# EAGLE design ProgramMemory (EAGLE 9.6.2)
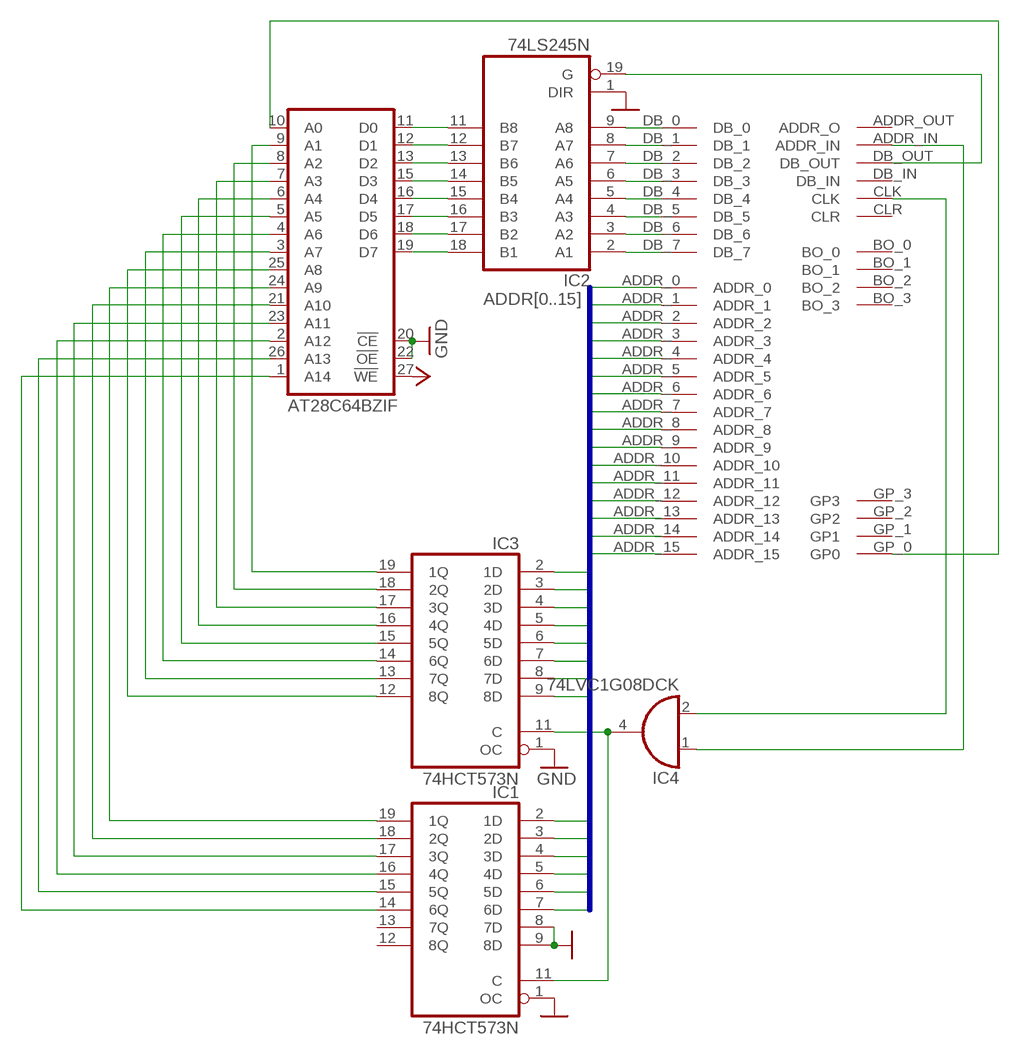
[diagram p0: schematic, sheet 1]

## Parts
IC1  74HCT573N  [DIL20]
IC2  74LS245N  [DIL20]
IC3  74HCT573N  [DIL20]
IC4  74LVC1G08DCK  [SC70-5]
U$1  BACKPLATE_INTERFACEEDGE_FINGER  [BACK_INTERFACE-FOOT]
U$2  AT28C64BZIF  [28-WIDE_ZIF-FOOT]

## Nets
ADDR0: IC3.2(1D) U$1.ADDR_0
ADDR1: IC3.3(2D) U$1.ADDR_1
ADDR2: IC3.4(3D) U$1.ADDR_2
ADDR3: IC3.5(4D) U$1.ADDR_3
ADDR4: IC3.6(5D) U$1.ADDR_4
ADDR5: IC3.7(6D) U$1.ADDR_5
ADDR6: IC3.8(7D) U$1.ADDR_6
ADDR7: IC3.9(8D) U$1.ADDR_7
ADDR8: IC1.2(1D) U$1.ADDR_8
ADDR9: IC1.3(2D) U$1.ADDR_9
ADDR10: IC1.4(3D) U$1.ADDR_10
ADDR11: IC1.5(4D) U$1.ADDR_11
ADDR12: IC1.6(5D) U$1.ADDR_12
ADDR13: IC1.7(6D) U$1.ADDR_13
ADDR14: U$1.ADDR_14
ADDR15: U$1.ADDR_15
DATA0: IC2.9(A8) U$1.DB_0
DATA1: IC2.8(A7) U$1.DB_1
DATA2: IC2.7(A6) U$1.DB_2
DATA3: IC2.6(A5) U$1.DB_3
DATA4: IC2.5(A4) U$1.DB_4
DATA5: IC2.4(A3) U$1.DB_5
DATA6: IC2.3(A2) U$1.DB_6
DATA7: IC2.2(A1) U$1.DB_7
GND: IC1.1(OC) IC1.8(7D) IC1.9(8D) IC2.1(DIR) IC3.1(OC) U$2.20(!CE) U$2.22(!OE)
N$1: U$1.GP_0(GP0) U$2.10(A0)
N$2: IC3.19(1Q) U$2.9(A1)
N$3: IC3.18(2Q) U$2.8(A2)
N$4: IC3.17(3Q) U$2.7(A3)
N$5: IC3.16(4Q) U$2.6(A4)
N$6: IC3.15(5Q) U$2.5(A5)
N$7: IC3.14(6Q) U$2.4(A6)
N$8: IC3.13(7Q) U$2.3(A7)
N$9: IC3.12(8Q) U$2.25(A8)
N$10: IC1.19(1Q) U$2.24(A9)
N$11: IC1.18(2Q) U$2.21(A10)
N$12: IC1.17(3Q) U$2.23(A11)
N$13: IC1.16(4Q) U$2.2(A12)
N$14: IC1.15(5Q) U$2.26(A13)
N$15: IC1.14(6Q) U$2.1(A14)
N$16: IC1.11(C) IC3.11(C) IC4.4(O)
N$17: IC4.2(I1) U$1.CLK
N$18: IC4.1(I0) U$1.ADDR_IN
N$20: IC2.19(G) U$1.DB_OUT
RS_BREAKOUT0: IC2.11(B8) U$2.11(D0)
RS_BREAKOUT1: IC2.12(B7) U$2.12(D1)
RS_BREAKOUT2: IC2.13(B6) U$2.13(D2)
RS_BREAKOUT3: IC2.14(B5) U$2.15(D3)
RS_BREAKOUT4: IC2.15(B4) U$2.16(D4)
RS_BREAKOUT5: IC2.16(B3) U$2.17(D5)
RS_BREAKOUT6: IC2.17(B2) U$2.18(D6)
RS_BREAKOUT7: IC2.18(B1) U$2.19(D7)
VCC: U$2.27(!WE)
Unconnected: IC1.12(8Q) IC1.13(7Q) U$1.ADDR_OUT(ADDR_O) U$1.BO_0 U$1.BO_1 U$1.BO_2 U$1.BO_3 U$1.CLR U$1.DB_IN U$1.GP_1(GP1) U$1.GP_2(GP2) U$1.GP_3(GP3) U$1.NC_0 U$1.NC_1 U$1.NC_2 U$1.NC_3 U$1.NC_4 U$1.NC_5 U$1.NC_6 U$1.NC_7 U$1.NC_8 U$1.NC_9 U$1.NC_10 U$1.NC_11 U$1.NC_12 U$1.NC_13 U$1.NC_14 U$1.NC_15 U$1.NC_16 U$1.NC_17 U$1.NC_18 U$1.NC_19 U$1.NC_20 U$1.NC_21

## Buses
ADDR[0..15]

## Power pins joined to a net without a drawn wire
GND: IC1.10(GND) IC2.10(GND) IC3.10(GND) IC4.3(GND) U$1.GND_0(GND) U$1.GND_1(GND) U$2.14(GND)
VCC: IC1.20(VCC) IC2.20(VCC) IC3.20(VCC) IC4.5(VCC) U$1.VCC_0(VCC) U$1.VCC_1(VCC) U$2.28(VCC)

## Library data of the parts
IC1 IC3 = 74xx-eu:74*573: 8-bit D latch BUS DRIVER
IC2 = 74xx-eu:74*245: Octal BUS TRANSCEIVER, 3-state
IC4 = 74xx-little-de:74*1G08: 2-input AND gate
U$1 = Computer:BACKPLATE_INTERFACE
U$2 = Computer:AT28C64B

## Board
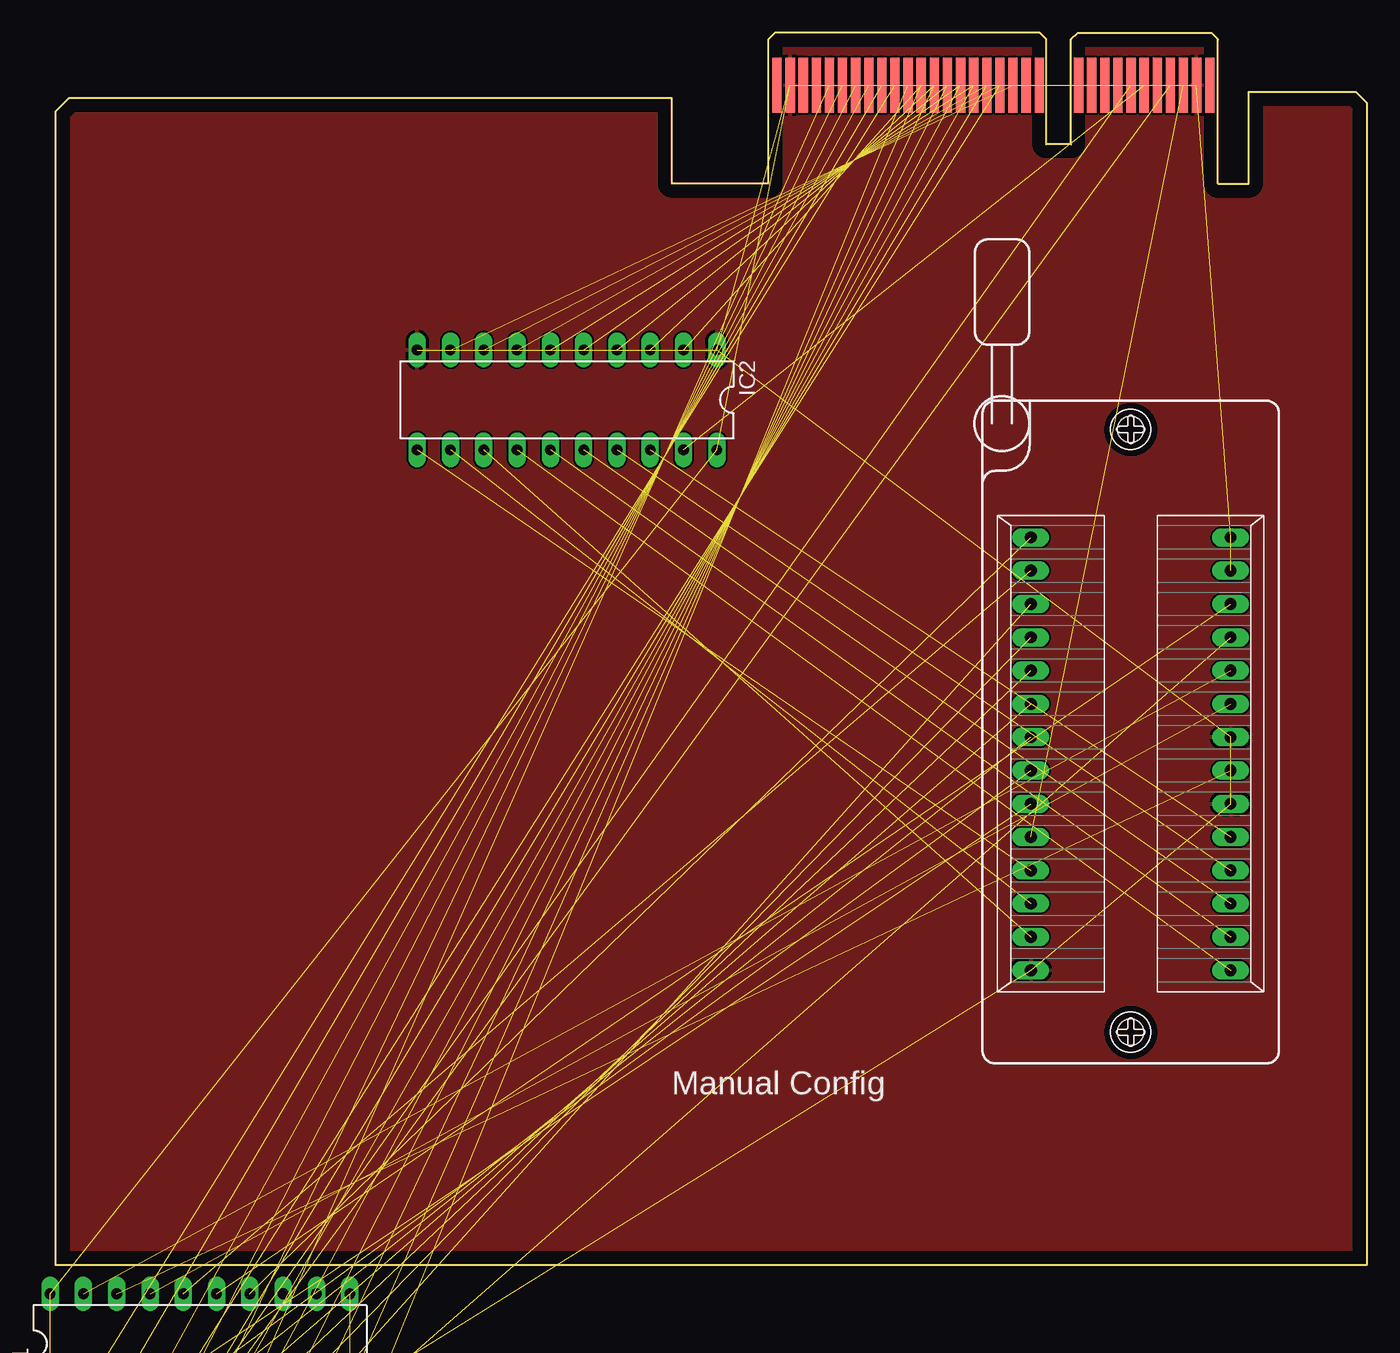
[diagram p1: board, top side]
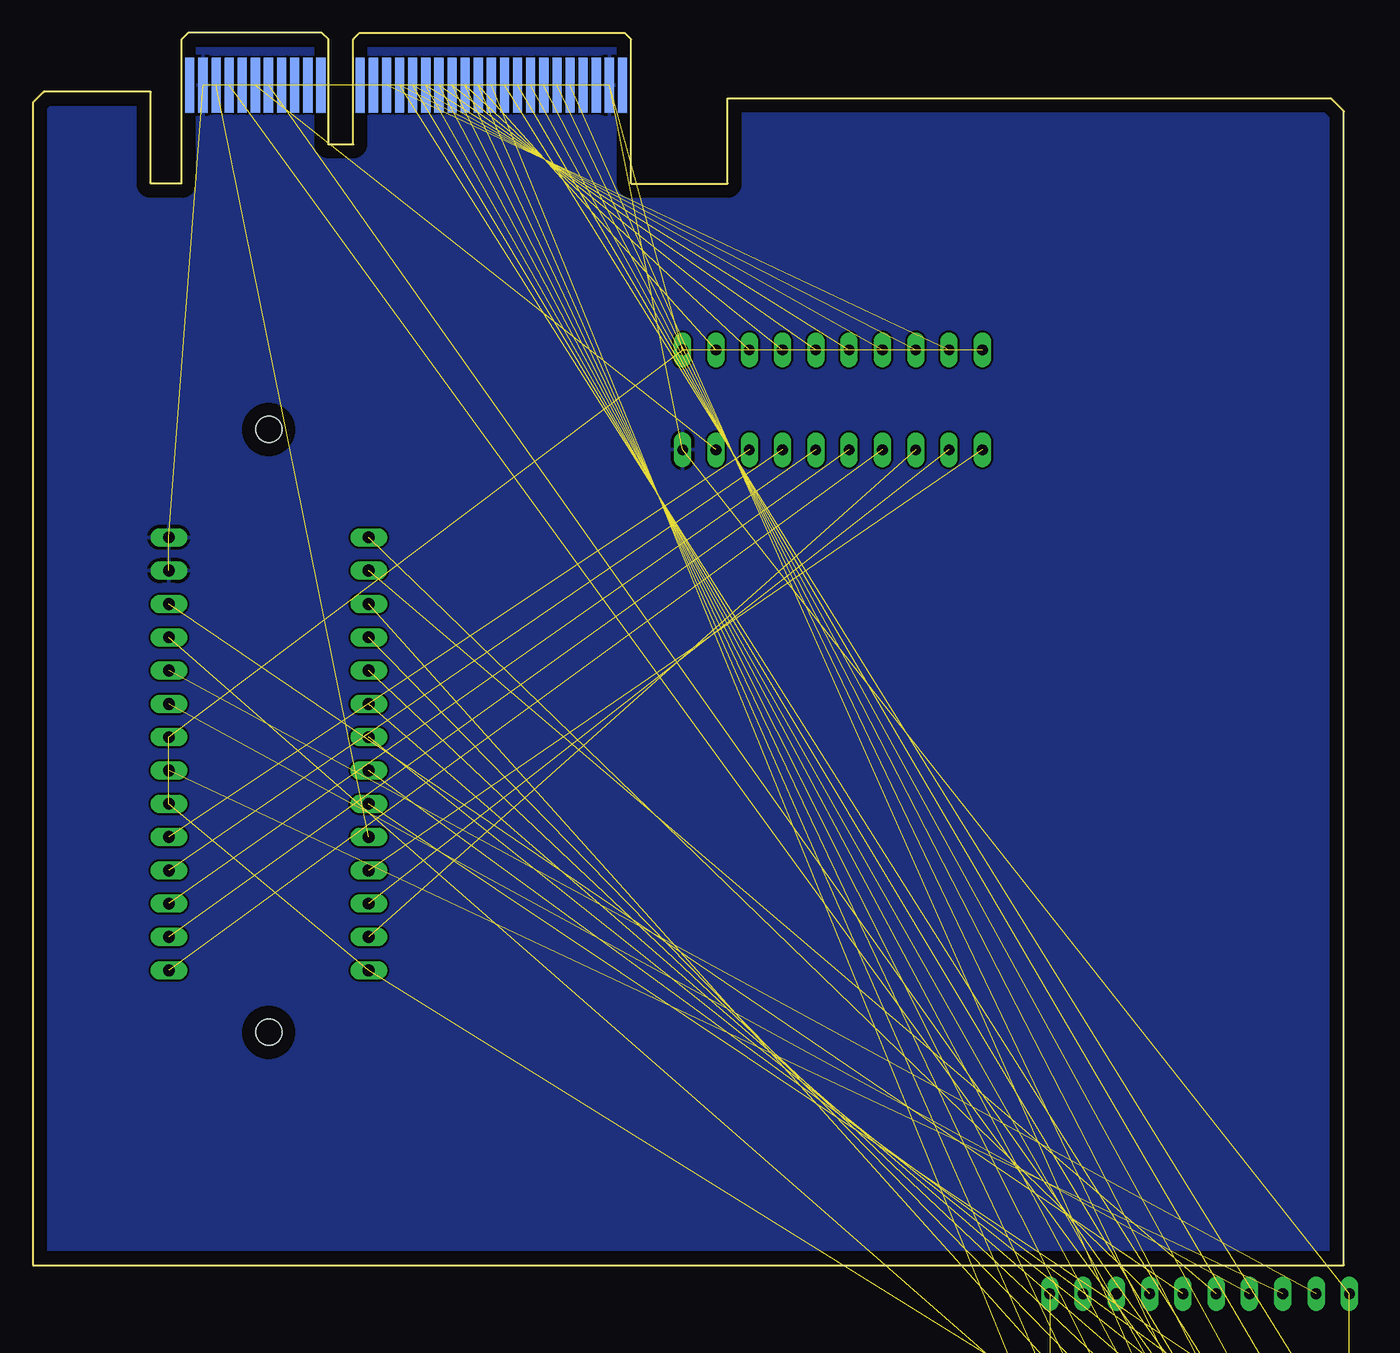
[diagram p2: board, bottom side, seen from below]

Size 100 x 94 mm. Coordinates in mm from the lower left corner, seen from the top.
Outline: 0,0 0,88 1,89 47,89 47,82.5 54.35,82.5 54.35,93.5 54.85,94 75.05,94 75.55,93.5 75.55,85.5 77.45,85.5 77.45,93.5 77.95,94 88.15,94 88.65,93.5 88.65,82.5 91,82.5 91,89.5 99.15,89.5 100,88.65 100,0 0,0
Copper layers (1*16): Top 0.035mm / dielectric 1.5mm / Bottom 0.035mm
Design rules "default *": minimum track width 19mil, minimum drill 0.35mm, track to track 6mil, track to pad 6mil, pad to pad 6mil, via to via 6mil, smd to smd 6mil, copper to edge 40mil, drill to drill 6mil, minimum pad ring 10mil, minimum via ring 8mil, stop-mask expansion 4mil, vias tented up to drill 0mil, thermal gap 10mil

### Footprints (pad centres in the part's own frame; a part is rotated, then mirrored left to right if it is on the bottom)
DIL20 = drill 0.813 long: 1 -11.43,-3.81; 2 -8.89,-3.81; 3 -6.35,-3.81; 4 -3.81,-3.81; 5 -1.27,-3.81; 6 1.27,-3.81; 7 3.81,-3.81; 8 6.35,-3.81; 9 8.89,-3.81; 10 11.43,-3.81; 11 11.43,3.81; 12 8.89,3.81; 13 6.35,3.81; 14 3.81,3.81; 15 1.27,3.81; 16 -1.27,3.81; 17 -3.81,3.81; 18 -6.35,3.81; 19 -8.89,3.81; 20 -11.43,3.81
SC70-5 = smd 0.4 x 0.7: 1 -0.65,-0.85; 2 0,-0.85; 3 0.65,-0.85; 4 0.65,0.85; 5 -0.65,0.85
BACK_INTERFACE-FOOT = smd 0.7 x 4.2: ADDR_0 17.02,0; ADDR_1 16.02,0; ADDR_2 15.02,0; ADDR_3 14.02,0; ADDR_4 13.02,0; ADDR_5 12.02,0; ADDR_6 11.02,0; ADDR_7 10.02,0; ADDR_8 9.02,0; ADDR_9 8.02,0; ADDR_10 7.02,0; ADDR_11 6.02,0; ADDR_12 5.02,0; ADDR_13 4.02,0; ADDR_14 3.02,0; ADDR_15 2.02,0; ADDR_IN 27.02,0; ADDR_OUT 26.02,0; CLK 30.02,0; CLR 31.02,0; DB_IN 29.02,0; DB_OUT 28.02,0; GND_0 32.02,0; GND_1 1.02,0; NC_0 33.02,0; NC_1 25.02,0; NC_2 24.02,0; NC_3 23.02,0; NC_4 20.02,0; NC_5 19.02,0; NC_6 18.02,0; NC_7 0.02,0 | smd 0.7 x 4.2 bottom: BO_0 27.02,0; BO_1 26.02,0; BO_2 25.02,0; BO_3 24.02,0; DB_0 18.02,0; DB_1 17.02,0; DB_2 16.02,0; DB_3 15.02,0; DB_4 14.02,0; DB_5 13.02,0; DB_6 12.02,0; DB_7 11.02,0; GP_0 31.02,0; GP_1 30.02,0; GP_2 29.02,0; GP_3 28.02,0; NC_8 33.02,0; NC_9 23.02,0; NC_10 20.02,0; NC_11 19.02,0; NC_12 10.02,0; NC_13 9.02,0; NC_14 8.02,0; NC_15 7.02,0; NC_16 6.02,0; NC_17 5.02,0; NC_18 4.02,0; NC_19 3.02,0; NC_20 2.02,0; NC_21 0.02,0; VCC_0 32.02,0; VCC_1 1.02,0
28-WIDE_ZIF-FOOT = drill 0.9 long: 1 -16.51,-7.62; 2 -13.97,-7.62; 3 -11.43,-7.62; 4 -8.89,-7.62; 5 -6.35,-7.62; 6 -3.81,-7.62; 7 -1.27,-7.62; 8 1.27,-7.62; 9 3.81,-7.62; 10 6.35,-7.62; 11 8.89,-7.62; 12 11.43,-7.62; 13 13.97,-7.62; 14 16.51,-7.62; 15 16.51,7.62; 16 13.97,7.62; 17 11.43,7.62; 18 8.89,7.62; 19 6.35,7.62; 20 3.81,7.62; 21 1.27,7.62; 22 -1.27,7.62; 23 -3.81,7.62; 24 -6.35,7.62; 25 -8.89,7.62; 26 -11.43,7.62; 27 -13.97,7.62; 28 -16.51,7.62 | hole 2: 21.24,0; -24.74,0

### Placement (x,y rotation side)
IC1  11,-6 0 top
IC2  39,66 180 top
IC3  11,-17 0 top  (outside the outline)
IC4  0,-26 0 top  (outside the outline)
U$1  55,90 0 top
U$2  82,39 270 top

### Tracks (layer width: path | path; a pad name or v marks a point on that pad's centre or on a via)
ADDR0  (1 unrouted)
ADDR1  (1 unrouted)
ADDR2  (1 unrouted)
ADDR3  (1 unrouted)
ADDR4  (1 unrouted)
ADDR5  (1 unrouted)
ADDR6  (1 unrouted)
ADDR7  (1 unrouted)
ADDR8  (1 unrouted)
ADDR9  (1 unrouted)
ADDR10  (1 unrouted)
ADDR11  (1 unrouted)
ADDR12  (1 unrouted)
ADDR13  (1 unrouted)
DATA0  (1 unrouted)
DATA1  (1 unrouted)
DATA2  (1 unrouted)
DATA3  (1 unrouted)
DATA4  (1 unrouted)
DATA5  (1 unrouted)
DATA6  (1 unrouted)
DATA7  (1 unrouted)
GND  (13 unrouted)
  pour Top: 47,89 47,82.43 46.99,82.42 54.23,82.42 54.36,82.55 54.36,93.36 55,94 75,94 75.56,93.44 75.56,85.47 77.47,85.47 77.47,93.47 78,94 88.12,94 88.65,93.47 88.65,82.42 90.93,82.42 91.06,82.55 91.06,89.41 99.19,89.41 99.95,88.65 99.95,0.05 100,0 0,0 0,88 1,89
N$1  (1 unrouted)
N$2  (1 unrouted)
N$3  (1 unrouted)
N$4  (1 unrouted)
N$5  (1 unrouted)
N$6  (1 unrouted)
N$7  (1 unrouted)
N$8  (1 unrouted)
N$9  (1 unrouted)
N$10  (1 unrouted)
N$11  (1 unrouted)
N$12  (1 unrouted)
N$13  (1 unrouted)
N$14  (1 unrouted)
N$15  (1 unrouted)
N$16  (2 unrouted)
N$17  (1 unrouted)
N$18  (1 unrouted)
N$20  (1 unrouted)
RS_BREAKOUT0  (1 unrouted)
RS_BREAKOUT1  (1 unrouted)
RS_BREAKOUT2  (1 unrouted)
RS_BREAKOUT3  (1 unrouted)
RS_BREAKOUT4  (1 unrouted)
RS_BREAKOUT5  (1 unrouted)
RS_BREAKOUT6  (1 unrouted)
RS_BREAKOUT7  (1 unrouted)
VCC  (7 unrouted)
  pour Bottom: 0,88 1,89 47,89 46.99,88.99 46.99,82.42 54.23,82.42 54.36,82.55 54.36,93.36 55,94 75.04,94 75.56,93.47 75.56,85.47 77.47,85.47 77.47,93.47 78,94 88.12,94 88.65,93.47 88.65,82.42 90.93,82.42 91.06,82.55 91.06,89.41 99.19,89.41 99.95,88.65 99.95,0.05 100,0 0,0

### Text on the board
tNames: Manual Config